# EAGLE design fanatone-adc2 (EAGLE 7.5.0)
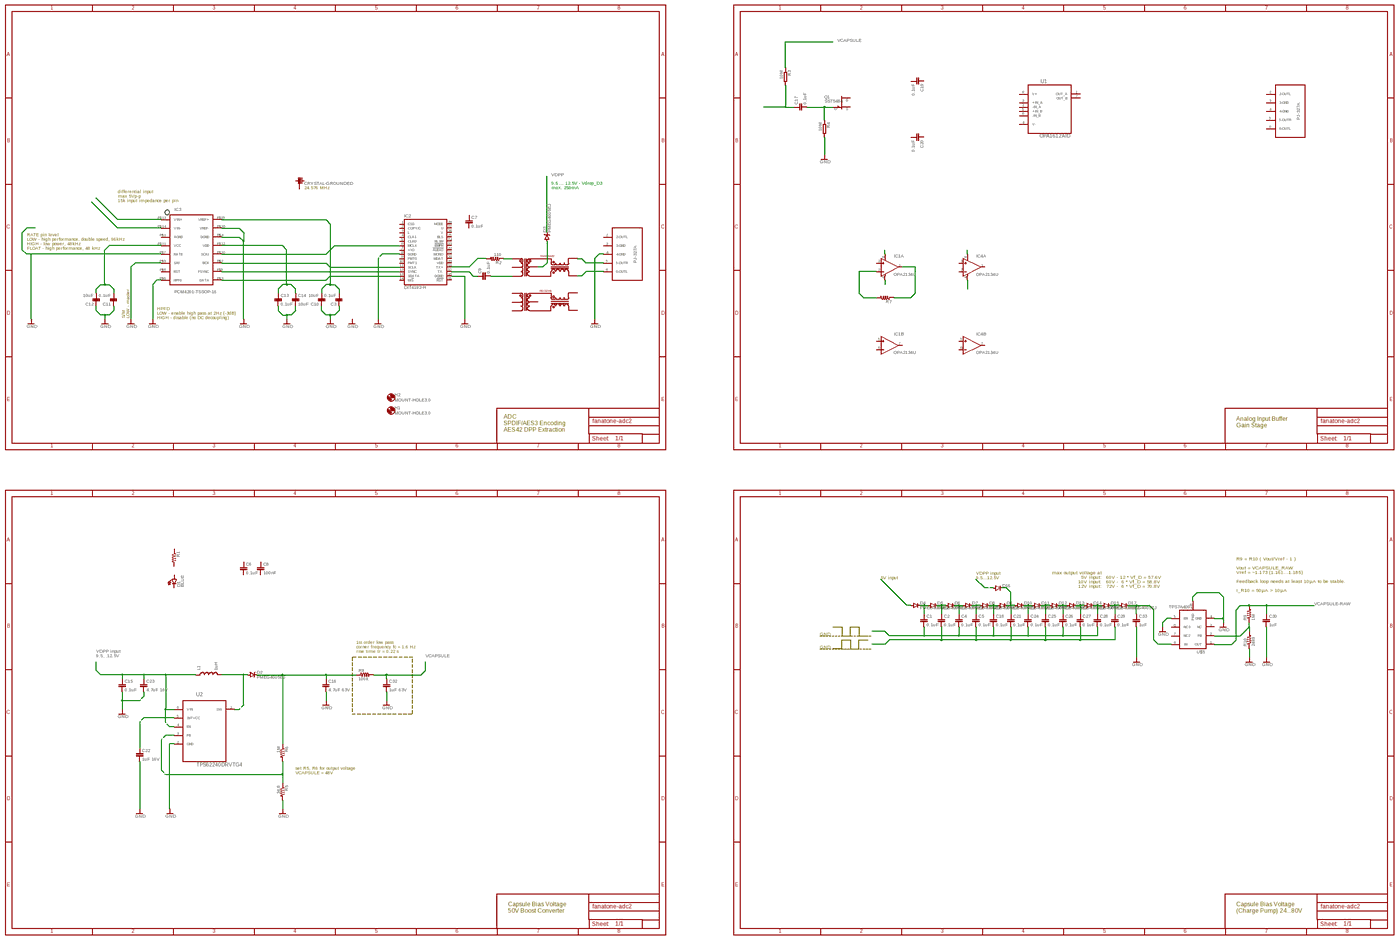
[diagram p0: schematic, sheet 1, overview]
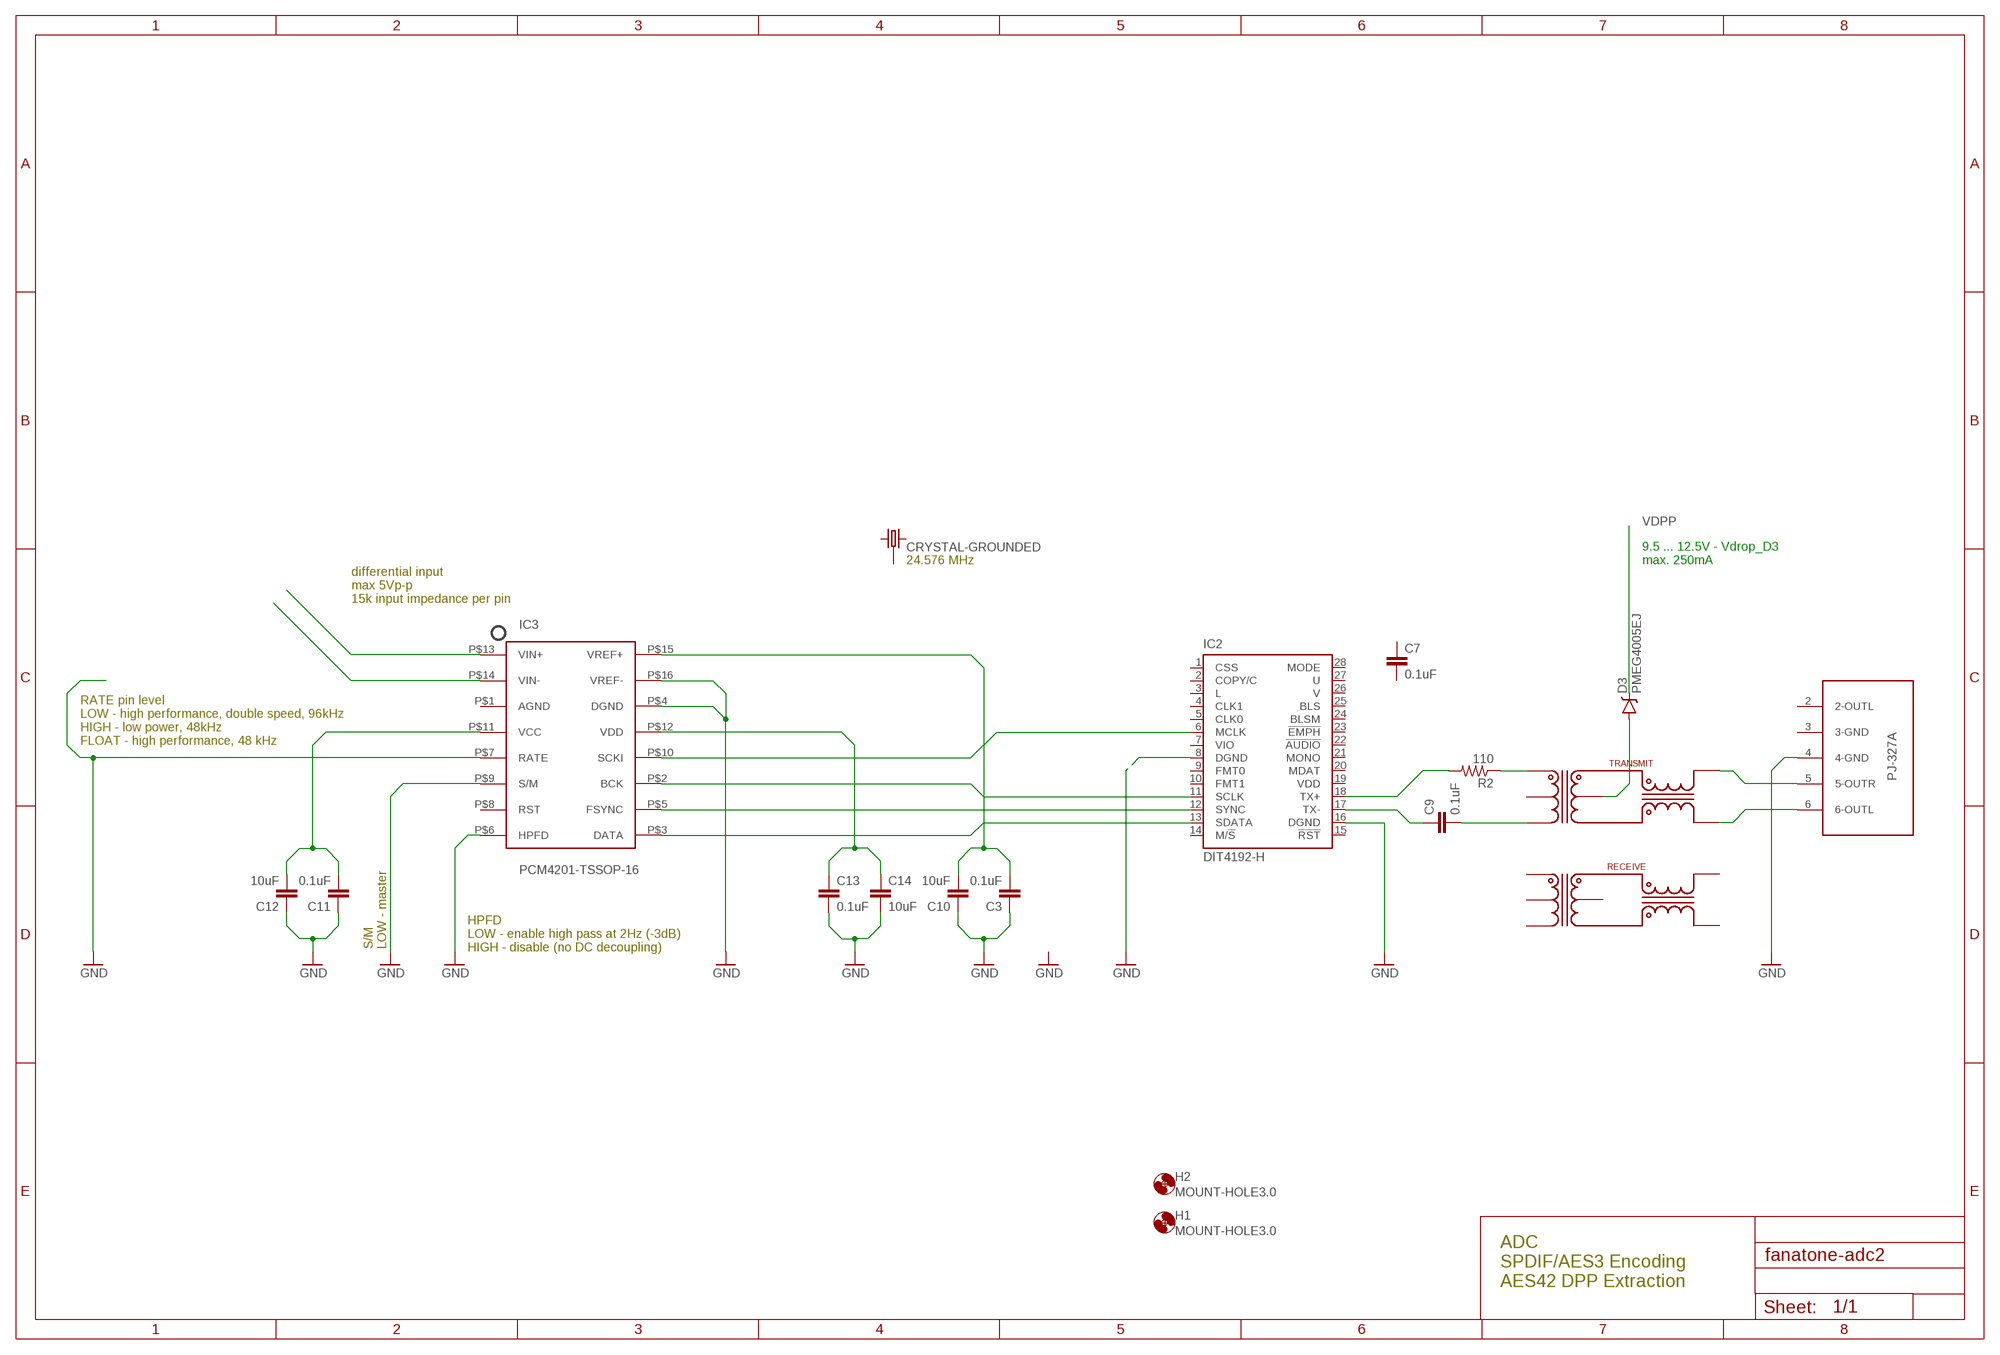
[diagram p1: schematic, sheet 1, part 1 of 4]
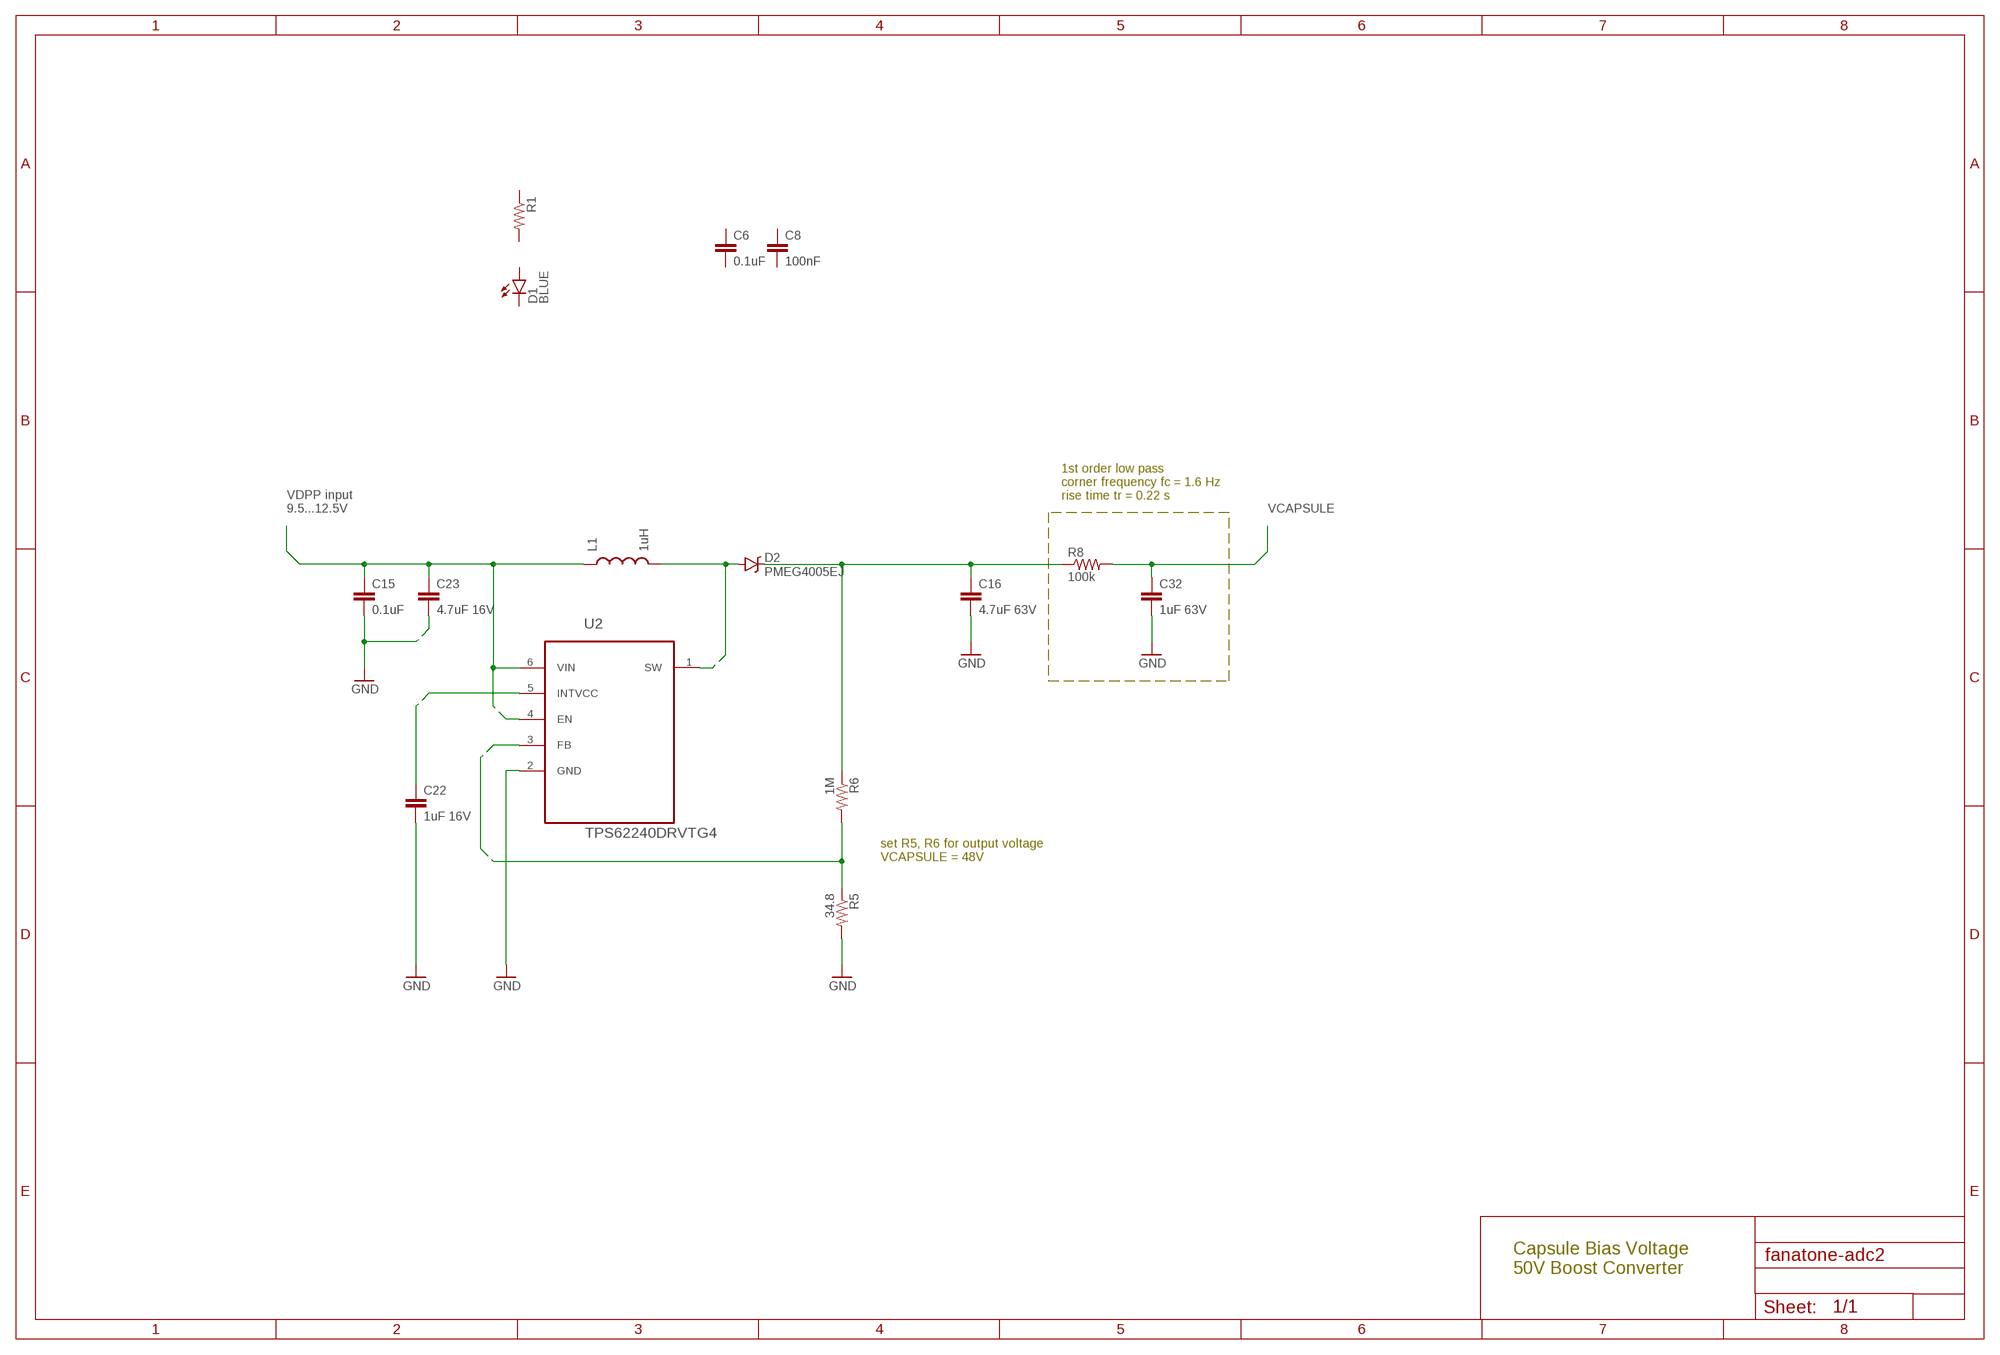
[diagram p2: schematic, sheet 1, part 2 of 4]
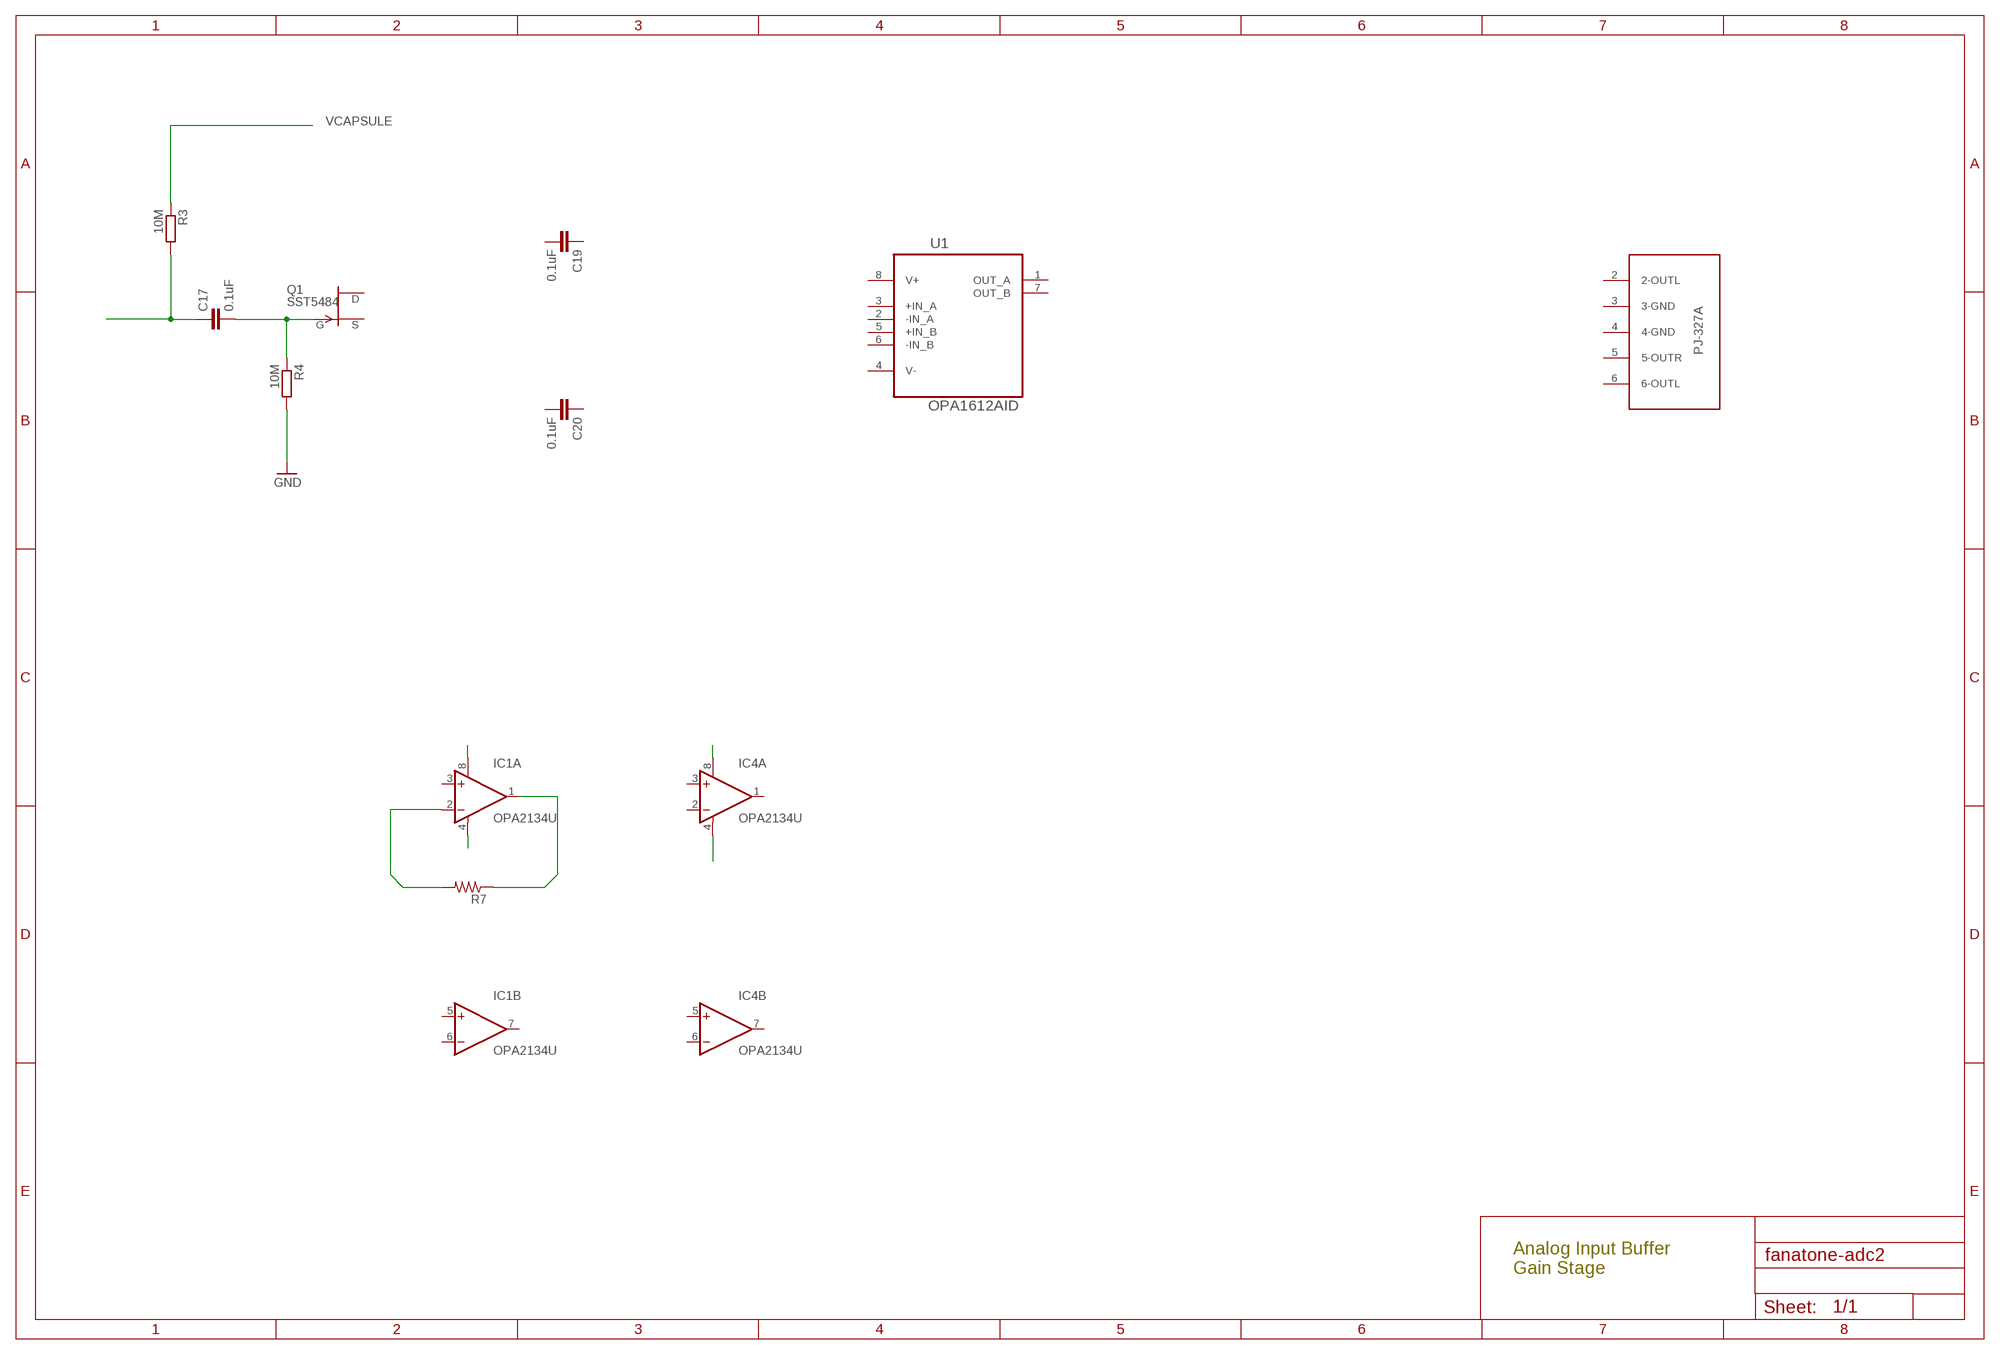
[diagram p3: schematic, sheet 1, part 3 of 4]
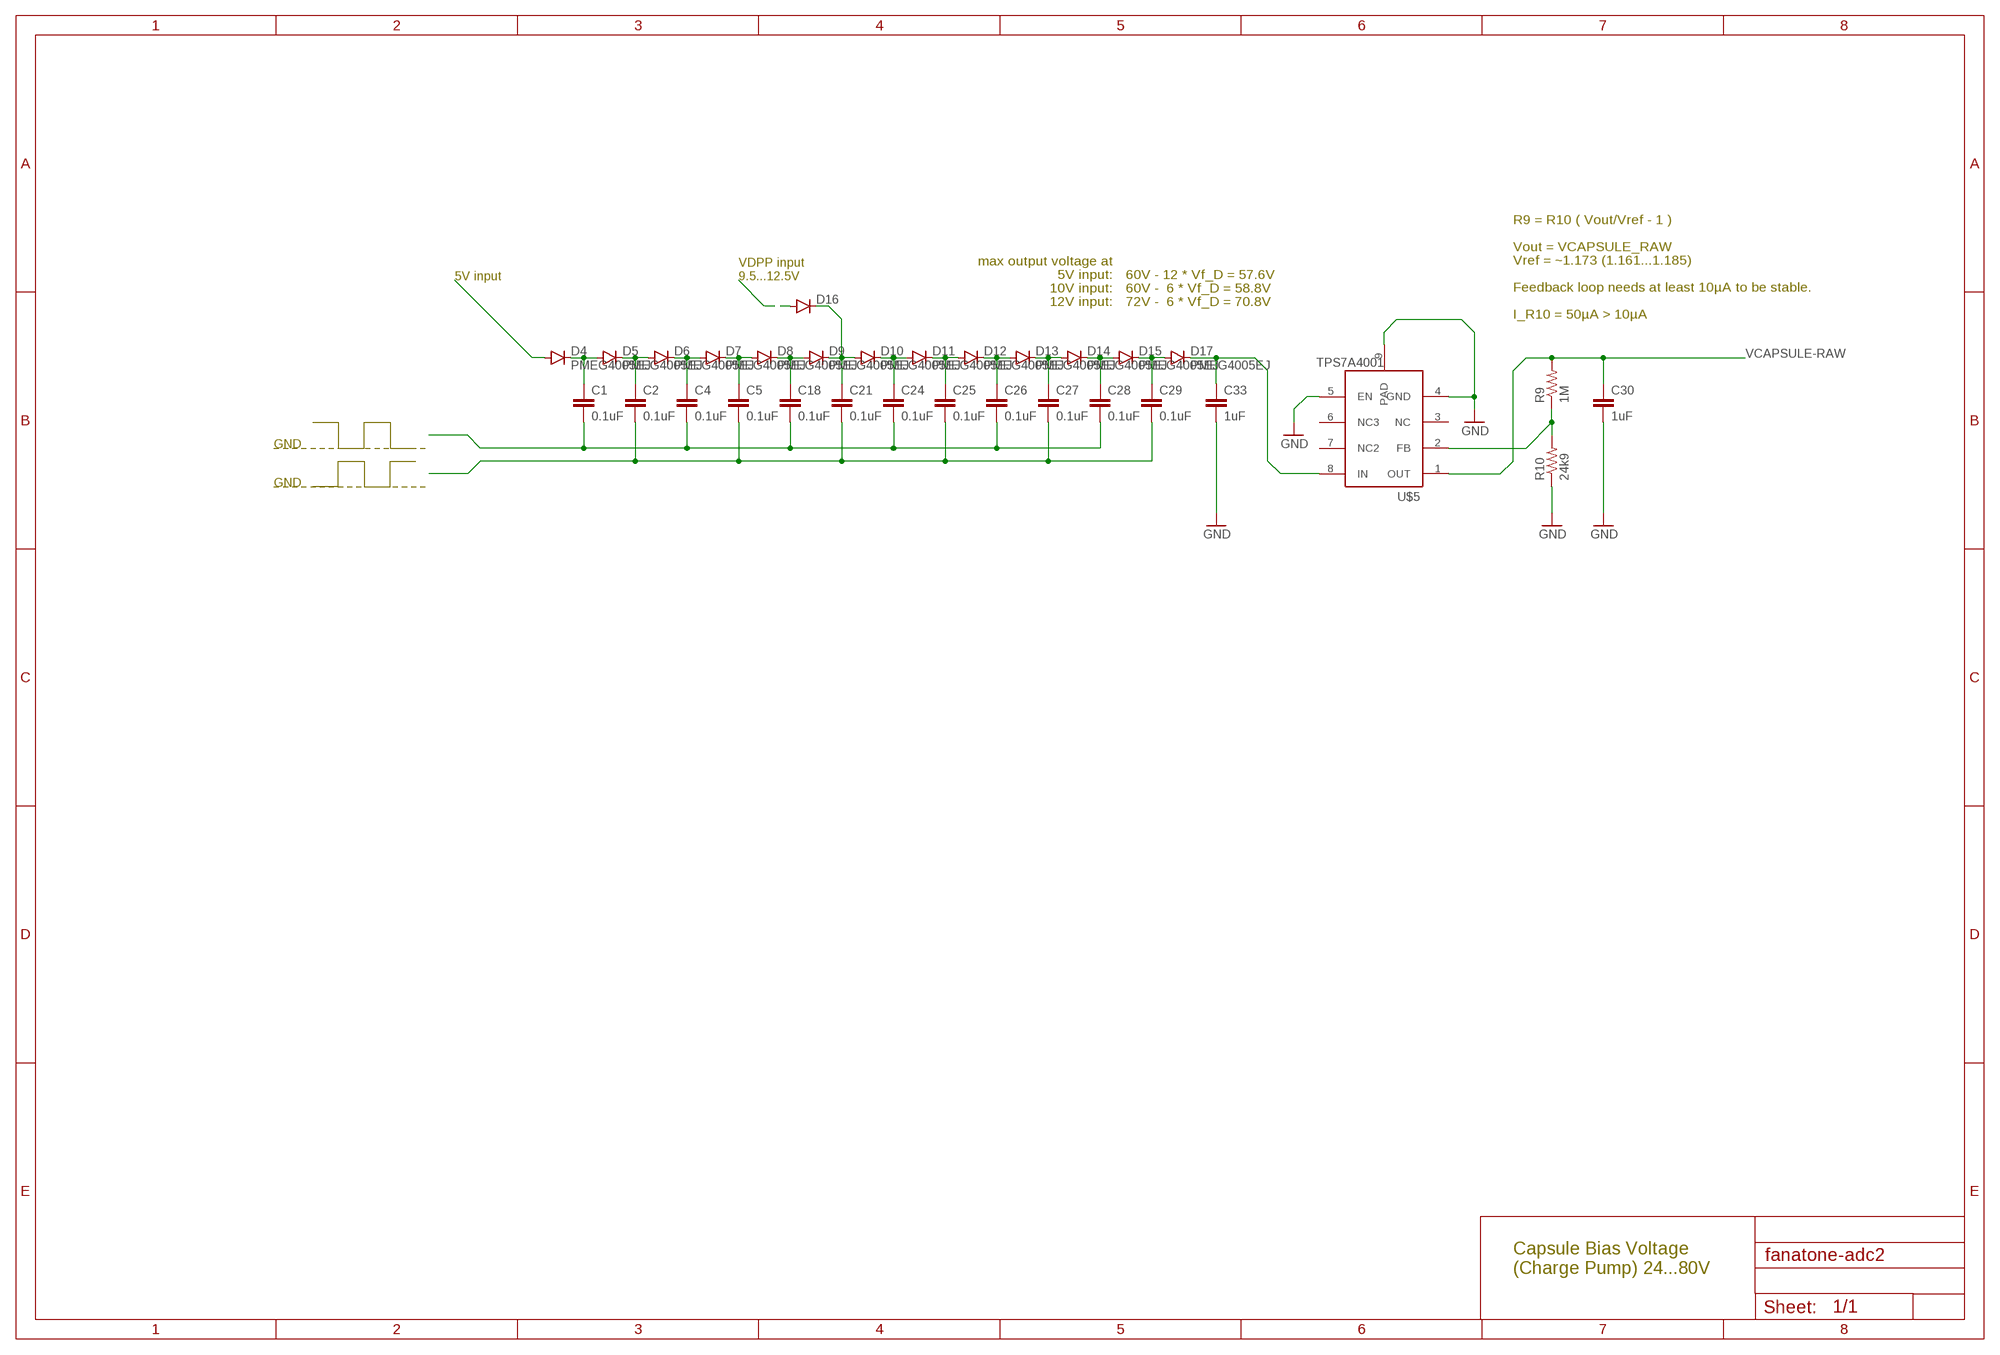
[diagram p4: schematic, sheet 1, part 4 of 4]

## Parts
C1  0.1uF  0.1UF-16V(+-10%)(0402)  [0402-CAP]
C2  0.1uF  0.1UF-16V(+-10%)(0402)  [0402-CAP]
C3  0.1uF  0.1UF-16V(+-10%)(0402)  [0402-CAP]
C4  0.1uF  0.1UF-16V(+-10%)(0402)  [0402-CAP]
C5  0.1uF  0.1UF-16V(+-10%)(0402)  [0402-CAP]
C6  0.1uF  0.1UF-16V(+-10%)(0402)  [0402-CAP]
C7  0.1uF  0.1UF-16V(+-10%)(0402)  [0402-CAP]
C8  100nF  CAP0402-CAP  [0402-CAP]
C9  0.1uF  0.1UF-16V(+-10%)(0402)  [0402-CAP]
C10  10uF  CAP0805  [0805]
C11  0.1uF  0.1UF-16V(+-10%)(0402)  [0402-CAP]
C12  10uF  CAP0805  [0805]
C13  0.1uF  0.1UF-16V(+-10%)(0402)  [0402-CAP]
C14  10uF  CAP0805  [0805]
C15  0.1uF  0.1UF-16V(+-10%)(0402)  [0402-CAP]
C16  4.7uF 63V  CAP0805  [0805]
C17  0.1uF  0.1UF-16V(+-10%)(0402)  [0402-CAP]
C18  0.1uF  0.1UF-16V(+-10%)(0402)  [0402-CAP]
C19  0.1uF  0.1UF-16V(+-10%)(0402)  [0402-CAP]
C20  0.1uF  0.1UF-16V(+-10%)(0402)  [0402-CAP]
C21  0.1uF  0.1UF-16V(+-10%)(0402)  [0402-CAP]
C22  1uF 16V  CAP0805  [0805]
C23  4.7uF 16V  CAP0805  [0805]
C24  0.1uF  0.1UF-16V(+-10%)(0402)  [0402-CAP]
C25  0.1uF  0.1UF-16V(+-10%)(0402)  [0402-CAP]
C26  0.1uF  0.1UF-16V(+-10%)(0402)  [0402-CAP]
C27  0.1uF  0.1UF-16V(+-10%)(0402)  [0402-CAP]
C28  0.1uF  0.1UF-16V(+-10%)(0402)  [0402-CAP]
C29  0.1uF  0.1UF-16V(+-10%)(0402)  [0402-CAP]
C30  1uF  CAP0805  [0805]
C32  1uF 63V  CAP0805  [0805]
C33  1uF  CAP0805  [0805]
D1  BLUE  LED-BLUE0603  [LED-0603]
D2  PMEG4005EJ  DIODE-SCHOTTKY-PMEG4005EJ  [SOD-323]
D3  PMEG4005EJ  DIODE-SCHOTTKY-PMEG4005EJ  [SOD-323]
D4  PMEG4005EJ  DIODESOD523  [SOD523]
D5  PMEG4005EJ  DIODESOD523  [SOD523]
D6  PMEG4005EJ  DIODESOD523  [SOD523]
D7  PMEG4005EJ  DIODESOD523  [SOD523]
D8  PMEG4005EJ  DIODESOD523  [SOD523]
D9  PMEG4005EJ  DIODESOD523  [SOD523]
D10  PMEG4005EJ  DIODESOD523  [SOD523]
D11  PMEG4005EJ  DIODESOD523  [SOD523]
D12  PMEG4005EJ  DIODESOD523  [SOD523]
D13  PMEG4005EJ  DIODESOD523  [SOD523]
D14  PMEG4005EJ  DIODESOD523  [SOD523]
D15  PMEG4005EJ  DIODESOD523  [SOD523]
D16  DIODESOD523  [SOD523]
D17  PMEG4005EJ  DIODESOD523  [SOD523]
H1  MOUNT-HOLE3.0  [3,0]
H2  MOUNT-HOLE3.0  [3,0]
IC1  OPA2134U  [SO08]
IC2  DIT4192-H  [PW_R-PDSO-G28]
IC3  PCM4201-TSSOP-16  [TSSOP-16]
IC4  OPA2134U  [SO08]
L1  1uH  INDUCTOR0805  [0805]
Q1  SST5484  [SOT23]
R1  RESISTOR0603-RES  [0603-RES]
R2  110  RESISTOR0603-RES  [0603-RES]
R3  10M  R-EU_R0805W  [R0805W]
R4  10M  R-EU_R0805W  [R0805W]
R5  34.8  RESISTOR0603-RES  [0603-RES]
R6  1M  RESISTOR0603-RES  [0603-RES]
R7  RESISTOR0603-RES  [0603-RES]
R8  100k  RESISTOR0603-RES  [0603-RES]
R9  1M  RESISTOR0603-RES  [0603-RES]
R10  24k9  RESISTOR0603-RES  [0603-RES]
U1  OPA1612AID  [SOIC127P600X175-8N]
U2  TPS62240DRVTG4  [SON65P210X210X80-7N]
U$1  CRYSTAL-GROUNDED  [CRYSTAL-SMD-5X3]
U$2  PJ-327A  [PJ-327A]
U$3  PJ-327A  [PJ-327A]
U$4  H1102  [H11XX]
U$5  TPS7A4001  [POWER-SOP8]

## Nets
3V3: C13.1 C14.1 IC3.P$12(VDD)
5V: C11.2 C12.2 IC3.P$11(VCC)
GND: C3.1 C10.1 C11.1 C12.1 C13.2 C14.2 C15.2 C16.2 C22.2 C23.2 C30.2 C32.2 C33.2 IC2.8(DGND) IC2.16(DGND) IC3.P$4(DGND) IC3.P$6(HPFD) IC3.P$7(RATE) IC3.P$9(S/M) IC3.P$16(VREF-) R4.2 R5.2 R10.1 U2.2(GND) U$2.4(4-GND) U$5.4(GND) U$5.5(EN) U$5.9(PAD)
N$1: C9.2 U$4.3
N$2: R2.1 U$4.1
N$3: C17.1 R3.2
N$4: C17.2 Q1.3(G) R4.1
N$5: C3.2 C10.2 IC3.P$15(VREF+)
N$6: IC2.18(TX+) R2.2
N$7: R5.1 R6.2 U2.3(FB)
N$8: C22.1 U2.5(INTVCC)
N$9: C9.1 IC2.17(TX-)
N$10: D3.A U$4.15
N$11: D2.A L1.2 U2.1(SW)
N$12: IC2.11(SCLK) IC3.P$2(BCK)
N$13: C4.1 D6.C D7.A
N$14: IC2.12(SYNC) IC3.P$5(FSYNC)
N$15: IC2.13(SDATA) IC3.P$3(DATA)
N$16: U$2.6(6-OUTL) U$4.14
N$17: IC2.6(MCLK) IC3.P$10(SCKI)
N$18: U$2.5(5-OUTR) U$4.16
N$19: IC3.P$13(VIN+)
N$20: IC3.P$14(VIN-)
N$21: IC1.1(A:OUT) R7.1
N$22: IC1.2(A:-IN) R7.2
N$23: IC1.4(A:V-)
N$24: IC1.8(A:V+)
N$25: IC4.8(A:V+)
N$26: IC4.4(A:V-)
N$27: C1.1 D4.C D5.A
N$28: C1.2 C4.2 C18.2 C24.2 C26.2 C28.2
N$29: C2.1 D5.C D6.A
N$30: C2.2 C5.2 C21.2 C25.2 C27.2 C29.2
N$31: D4.A
N$32: C29.1 D15.C D17.A
N$33: C5.1 D7.C D8.A
N$34: R9.1 R10.2 U$5.2(FB)
N$36: C18.1 D8.C D9.A
N$38: C21.1 D9.C D10.A D16.C
N$41: C24.1 D10.C D11.A
N$43: C25.1 D11.C D12.A
N$46: C26.1 D12.C D13.A
N$47: C27.1 D13.C D14.A
N$48: C28.1 D14.C D15.A
N$49: C33.1 D17.C U$5.8(IN)
VCAPSULE: C32.1 R3.1 R8.2
VCAPSULE-RAW: C16.1 C30.1 D2.C R6.1 R8.1 R9.2 U$5.1(OUT)
VDPP: C15.1 C23.1 D3.C D16.A L1.1 U2.4(EN) U2.6(VIN)
Unconnected: C6.1 C6.2 C7.1 C7.2 C8.1 C8.2 C19.1 C19.2 C20.1 C20.2 D1.A D1.C IC1.3(A:+IN) IC1.5(B:+IN) IC1.6(B:-IN) IC1.7(B:OUT) IC2.1(CSS) IC2.2(COPY/C) IC2.3(L) IC2.4(CLK1) IC2.5(CLK0) IC2.9(FMT0) IC2.10(FMT1) IC2.14(M/!S) IC2.15(!RST) IC2.20(MDAT) IC2.21(MONO) IC2.22(!AUDIO) IC2.23(!EMPH) IC2.24(BLSM) IC2.25(BLS) IC2.26(V) IC2.27(U) IC2.28(MODE) IC3.P$1(AGND) IC3.P$8(RST) IC4.1(A:OUT) IC4.2(A:-IN) IC4.3(A:+IN) IC4.5(B:+IN) IC4.6(B:-IN) IC4.7(B:OUT) Q1.1(D) Q1.2(S) R1.1 R1.2 U1.1(OUT_A) U1.2(-IN_A) U1.3(+IN_A) U1.5(+IN_B) U1.6(-IN_B) U1.7(OUT_B) U$1.1 U$1.2 U$1.3 U$1.4 U$2.2(2-OUTL) U$2.3(3-GND) U$3.2(2-OUTL) U$3.3(3-GND) U$3.4(4-GND) U$3.5(5-OUTR) U$3.6(6-OUTL) U$4.2 U$4.6 U$4.7 U$4.8 U$4.9 U$4.10 U$4.11 U$5.3(NC) U$5.6(NC3) U$5.7(NC2)

## Notes on the sheet
- 24.576 MHz
- 9.5 ... 12.5V - Vdrop_D3
  max. 250mA
- differential input
  max 5Vp-p
  15k input impedance per pin
- RATE pin level
  LOW - high performance, double speed, 96kHz
  HIGH - low power, 48kHz
  FLOAT - high performance, 48 kHz
- S/M
  LOW - master
- HPFD
  LOW - enable high pass at 2Hz (-3dB)
  HIGH - disable (no DC decoupling)
- Analog Input Buffer
  Gain Stage
- ADC
  SPDIF/AES3 Encoding
  AES42 DPP Extraction
- 5V input
- VDPP input
  9.5...12.5V
- max output voltage at
  5V input:
  10V input:
  12V input:
- 60V - 12 * Vf_D = 57.6V
  60V -  6 * Vf_D = 58.8V
  72V -  6 * Vf_D = 70.8V
- R9 = R10 ( Vout/Vref - 1 )
  
  Vout = VCAPSULE_RAW
  Vref = ~1.173 (1.161...1.185)
  
  Feedback loop needs at least 10µA to be stable.
  
  I_R10 = 50µA > 10µA
- GND
- GND
- 1st order low pass
  corner frequency fc = 1.6 Hz
  rise time tr = 0.22 s
- VDPP input
  9.5...12.5V
- set R5, R6 for output voltage
  VCAPSULE = 48V
- Capsule Bias Voltage
  50V Boost Converter
- Capsule Bias Voltage
  (Charge Pump) 24...80V

## Power pins joined to a net without a drawn wire
V+: U1.8(V+)
V-: U1.4(V-)
VDD: IC2.19(VDD)
VIO: IC2.7(VIO)

## Library data of the parts
C1-C7 C9 C11 C13 C15 C17-C21 C24-C29 = SparkFun-Capacitors:0.1UF-16V(+-10%)(0402); PROD_ID: CAP-12416
C8 C10 C12 C14 C16 C22 C23 C30 C32 C33 = SparkFun-Passives:CAP: Capacitor Standard 0603 ceramic capacitor, and 0.1" leaded capacitor.
D1 = SparkFun-LED:LED-BLUE: Blue LEDs for production use Various blue LEDs stocked by SparkFun production 0603 - DIO-08575 Rebel - DIO-09553 1206 - DIO-09911; PROD_ID: DIO-08575
D2 D3 = SparkFun-DiscreteSemi:DIODE-SCHOTTKY: Schottky diodes in SFE's production catalog BAT20J 1A 23V 0.62Vf RB751 120mA 40V 0.37Vf PMEG4005EJ 0.5A 40V 0.42Vf MBRA140 1A 40V 0.5Vf B340A 3A 40V SMA; PROD_ID: DIO-10955
D4-D17 = SparkFun-DiscreteSemi:DIODE: Diode These are standard reverse protection diodes and small signal diodes. SMA package can handle up to about 1A. SOD-323 can handle about 200mA. What the SOD-323 package when ordering, there are some mfgs out there that are 5-pin packages.
H1 H2 = holes:MOUNT-HOLE: MOUNTING HOLE with drill center marker
IC1 IC4 = burr-brown:OPA2134: Operational Amplifier; MF: TEXAS INSTRUMENTS; MPN: OPA2134UA; OC_FARNELL: 1206935; OC_NEWARK: 35C1847
IC2 = texas:DIT4192-H: 192kHz Digital Audio Transmitter Hardware Mode Source: http://focus.ti.com/lit/ds/symlink/dit4192.pdf; MF: TEXAS INSTRUMENTS; MPN: DIT4192IPW; OC_FARNELL: 7455057; OC_NEWARK: 74C9511
IC3 = TI-PCM4201:PCM4201
L1 = SparkFun-Passives:INDUCTOR: Inductors Basic Inductor/Choke - 0603 and 1206. Footprints are not proven and vary greatly between part numbers. INDUCTOR POWER 3.3UH 4.0A SMD 0.197" L x 0.197" W x 0.177" H (5.00mm x 5.00mm x 4.50mm)
Q1 = transistor-fet:?548*: N-Channel JFETs Source: VISHAY 2N5484.pdf Compatible: TO92 2N5245 J304 J305 U310 J308 J309 J310 TO72 2N4416 2N4416A 2N3823 2N4351 3N169 3N170 3N171 MFE3002 TO18 2N3796 2N3797 MFE825 Source: Motorola European Master Guide Pacge 3-59
R1 R2 R5-R10 = SparkFun-Passives:RESISTOR: Resistor Basic schematic elements and footprints for 0603, 1206, and PTH resistors.
R3 R4 = rcl:R-EU_: RESISTOR, European symbol
U1 = LT8330-boost-TSOT23:OPA1612AID: AUDIO OPERATIONAL AMPLIFIERS; MPN: OPA1612AID; OC_FARNELL: 1754265; OC_NEWARK: 25R6133; PACKAGE: SOIC-8; SUPPLIER: TI
U2 = LT8330-boost-TSOT23:TPS62240DRVTG4: 2.25 MHz 300 mA Step Down Converter in 2x2SON/TSOT23 Package; MPN: LT8330; PACKAGE: SON-6; SUPPLIER: Linear Technology
U$1 = SparkFun-FreqCtrl:CRYSTAL-GROUNDED
U$2 U$3 = PJ327A-TRS:PJ-327A
U$4 = trafo-pulse:H1102: PULSE SMT Ethernet transformer RX 1:1, TX 1:1, Central Tap
U$5 = SparkFun-AnalogIC:TPS7A4001

## Board
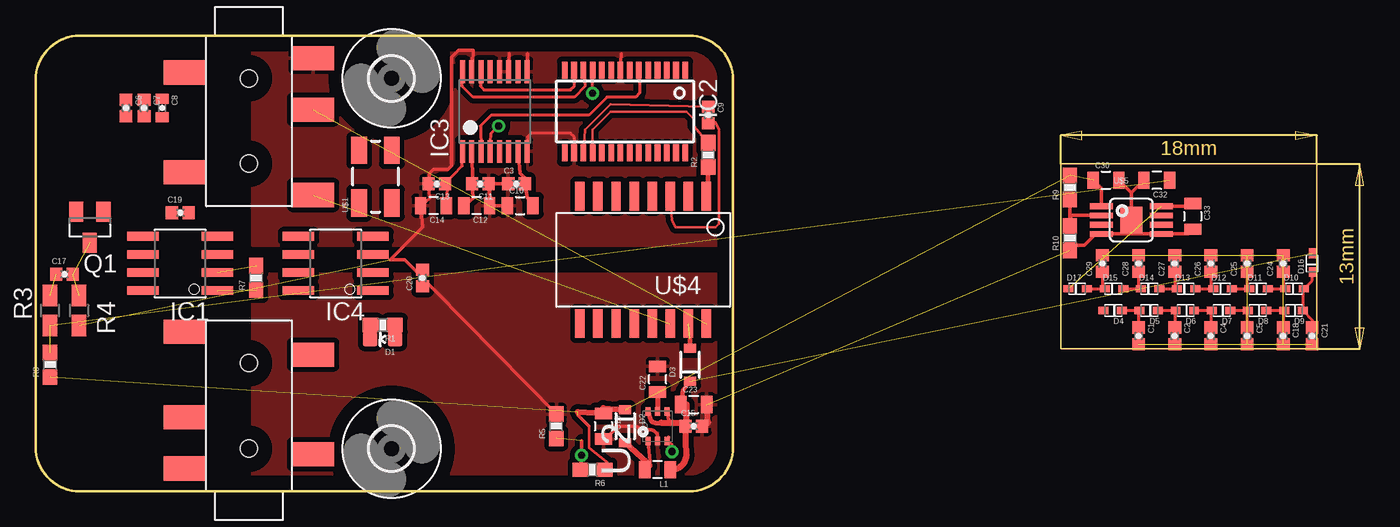
[diagram p5: board, top side]
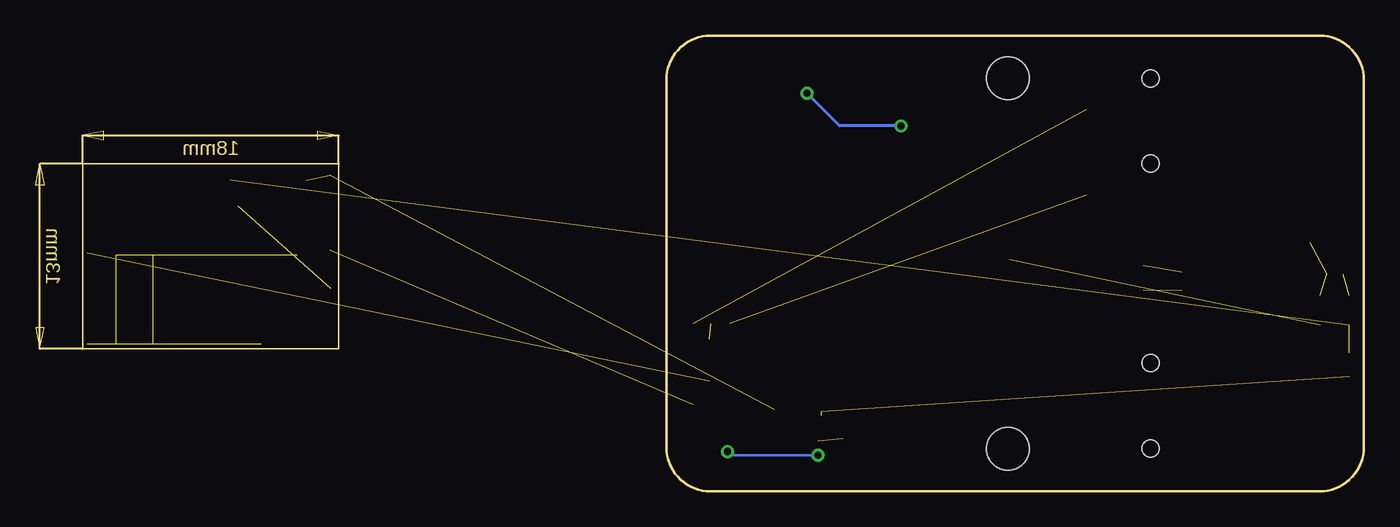
[diagram p6: board, bottom side, seen from below]

Size 90 x 32 mm. Coordinates in mm from the lower left corner, seen from the top.
Outline: 0,3.1 0,28.9 arc-90 3.1,32 45.9,32 arc-90 49,28.9 49,3.1 arc-90 45.9,0 3.1,0 arc-90 0,3.1
Outline: 72,23 72,10 90,10 90,23 72,23
Copper layers (1*16): Top 0.035mm / dielectric 1.5mm / Bottom 0.035mm
Design rules "default *": minimum track width 7mil, minimum drill 24mil, track to track 8mil, track to pad 8mil, pad to pad 8mil, via to via 8mil, smd to smd 8mil, copper to edge 40mil, drill to drill 8mil, minimum pad ring 10mil, minimum via ring 8mil, stop-mask expansion 1mil, vias tented up to drill 0mil, thermal gap 10mil

### Footprints (pad centres in the part's own frame; a part is rotated, then mirrored left to right if it is on the bottom)
0402-CAP = smd 0.85 x 0.9: 1 -0.58,0; 2 0.58,0
0402-CAP' = smd 0.7 x 0.9: 1 -0.65,0; 2 0.65,0
0805 = smd 0.8 x 1.2: 1 -0.9,0; 2 0.9,0
LED-0603 = smd 1 x 1: A 0,-0.877; C 0,0.877
SOD-323 = smd 0.63 x 0.83: A 1.15,0; C -1.15,0
SOD523 = smd 0.7 x 0.5: A 0.7,0; C -0.6,0
3,0 = hole 3: 0,0
SO08 = smd 0.61 x 2.21: 1 -1.905,-2.616; 2 -0.635,-2.616; 3 0.635,-2.616; 4 1.905,-2.616; 5 1.905,2.616; 6 0.635,2.616; 7 -0.635,2.616; 8 -1.905,2.616
PW_R-PDSO-G28 = smd 0.4 x 1.2: 1 -4.225,-2.9; 2 -3.575,-2.9; 3 -2.925,-2.9; 4 -2.275,-2.9; 5 -1.625,-2.9; 6 -0.975,-2.9; 7 -0.325,-2.9; 8 0.325,-2.9; 9 0.975,-2.9; 10 1.625,-2.9; 11 2.275,-2.9; 12 2.925,-2.9; 13 3.575,-2.9; 14 4.225,-2.9; 15 4.225,2.9; 16 3.575,2.9; 17 2.925,2.9; 18 2.275,2.9; 19 1.625,2.9; 20 0.975,2.9; 21 0.325,2.9; 22 -0.325,2.9; 23 -0.975,2.9; 24 -1.625,2.9; 25 -2.275,2.9; 26 -2.925,2.9; 27 -3.575,2.9; 28 -4.225,2.9
TSSOP-16 = smd 0.35 x 1.6: P$1 -0.325,2.8; P$2 -0.325,-2.8; P$3 -0.975,2.8; P$4 -1.625,2.8; P$5 -2.275,2.8; P$6 0.325,2.8; P$7 0.975,2.8; P$8 1.625,2.8; P$9 2.275,2.8; P$10 -0.975,-2.8; P$11 -1.625,-2.8; P$12 -2.275,-2.8; P$13 0.325,-2.8; P$14 0.975,-2.8; P$15 1.625,-2.8; P$16 2.275,-2.8
SOT23 = smd 1 x 1.4: 1 -0.95,-1.1; 2 0.95,-1.1; 3 0,1.1
0603-RES = smd 1.1 x 1: 1 -0.85,0; 2 0.85,0
R0805W = smd 1.5 x 1: 1 -1.052,0; 2 1.052,0
SOIC127P600X175-8N = smd 1.981 x 0.559: 1 -2.464,1.905; 2 -2.464,0.635; 3 -2.464,-0.635; 4 -2.464,-1.905; 5 2.464,-1.905; 6 2.464,-0.635; 7 2.464,0.635; 8 2.464,1.905
SON65P210X210X80-7N = smd 0.61 x 0.356: 1 -1.041,0.66; 2 -1.041,0; 3 -1.041,-0.66; 4 1.041,-0.66; 5 1.041,0; 6 1.041,0.66 | smd 0.003 x 0.003: 7 0,0
CRYSTAL-SMD-5X3 = smd 1.9 x 1.1: 1 -1.85,-1.15; 2 1.85,-1.15; 3 1.85,1.15; 4 -1.85,1.15
PJ-327A = smd 1.7 x 3: 2 9.6,-4.5; 3 2.6,-4.5; 4 1.6,4.5; 5 5.2,4.5; 6 11.2,4.5 | hole 1.2: 3,0; 9,0
H11XX = smd 0.66 x 2.032: 1 -4.445,-4.47; 2 -3.175,-4.47; 3 -1.905,-4.47; 4 -0.635,-4.47; 5 0.635,-4.47; 6 1.905,-4.47; 7 3.175,-4.47; 8 4.445,-4.47; 9 4.445,4.47; 10 3.175,4.47; 11 1.905,4.47; 12 0.635,4.47; 13 -0.635,4.47; 14 -1.905,4.47; 15 -3.175,4.47; 16 -4.445,4.47
POWER-SOP8 = smd 0.4 x 1.6: 1 -0.975,-2.1; 2 -0.325,-2.1; 3 0.325,-2.1; 4 0.975,-2.1; 5 0.975,2.1; 6 0.325,2.1; 7 -0.325,2.1; 8 -0.975,2.1 | smd 1.89 x 1.57: 9 0,0

### Placement (x,y rotation side)
C1  77.47,10.92 270 top
C2  80.01,10.92 270 top
C3  33.78,21.59 0 top
C4  82.55,10.92 270 top
C5  85.09,10.92 270 top
C6  6.35,26.92 270 top
C7  7.62,26.92 270 top
C8  100nF  [0402-CAP']  8.89,26.92 270 top
C9  47.24,26.42 270 top
C10  34.04,20.07 0 top
C11  31.24,21.59 180 top
C12  30.99,20.07 180 top
C13  28.19,21.59 180 top
C14  27.94,20.07 180 top
C15  46.23,4.57 0 top
C16  39.88,4.57 270 top
C17  2.03,15.24 0 top
C18  87.63,10.92 270 top
C19  10.16,19.56 0 top
C20  27.18,14.99 90 top
C21  89.66,10.92 270 top
C22  43.69,7.87 90 top
C23  46.23,6.1 0 top
C24  87.63,16 90 top
C25  85.09,16 90 top
C26  82.55,16 90 top
C27  80.01,16 90 top
C28  77.47,16 90 top
C29  74.93,16 90 top
C30  75.18,21.84 0 top
C32  78.74,21.84 180 top
C33  81.28,19.3 270 top
D1  24.38,10.67 90 top
D2  41.4,4.57 270 top
D3  45.97,8.89 90 top
D4  75.69,12.7 180 top
D5  78.23,12.7 180 top
D6  80.77,12.7 180 top
D7  83.31,12.7 180 top
D8  85.85,12.7 180 top
D9  88.39,12.7 180 top
D10  88.39,14.22 0 top
D11  85.85,14.22 0 top
D12  83.31,14.22 0 top
D13  80.77,14.22 0 top
D14  78.23,14.22 0 top
D15  75.69,14.22 0 top
D16  89.66,16 90 top
D17  73.15,14.22 0 top
H1  25,3 0 top
H2  25,29 0 top
IC1  10.16,16 90 top
IC2  41.4,26.67 180 top
IC3  32.26,26.67 0 top
IC4  21.08,16 90 top
L1  43.69,1.52 180 top
Q1  3.81,18.54 180 top
R1  24.38,11.68 180 top
R2  47.24,23.62 90 top
R3  1.02,12.7 90 top
R4  3.05,12.7 270 top
R5  36.58,4.57 90 top
R6  39.12,1.52 180 top
R7  15.49,14.99 90 top
R8  1.02,8.89 90 top
R9  72.64,21.34 90 top
R10  72.64,17.78 90 top
U1  61.98,40.64 0 top  (outside the outline)
U2  43.69,4.57 90 top
U$1  23.88,22.1 90 top
U$2  14.99,32 270 top
U$3  14.99,0 90 top
U$4  42.67,16.26 180 top
U$5  76.96,19.05 270 top

### Tracks (layer width: path | path; a pad name or v marks a point on that pad's centre or on a via)
3V3
  Top 0.203: C14.1 28.96,21.59 C13.1 29.97,22.86 IC3.P$12
5V
  Top 0.254: IC3.P$11 30.73,21.59 C11.2 30.73,20.57 C12.2
GND  (2 unrouted)
  Top 0.203: IC2.8 41.15,30.73 | IC3.P$7 33.27,30.73 | IC2.16 37.85,24.89 37.59,25.15 34.8,25.15 34.54,24.89 34.54,23.88 IC3.P$16 | C13.2 27.69,20.57 C14.2
  Top 0.254: C16.2 40.13,3.81 40.89,4.57 42.16,4.57 arc28 43.18,4.32 arc-90 43.69,3.81 U2.2 | C3.1 C11.1 32,20.07 | C10.1 32,20.07 | 32,20.07 C12.1 | C12.1 32,20.07 | 32,20.07 C12.1 | 32,20.07 C12.1 | C14.2 27.18,18.54 24.89,16.26 25.91,16.26 R5.2 | IC3.P$4 30.73,30.73 30.73,30.99 30.48,30.99 29.72,30.99 29.21,30.48 29.21,22.86 28.96,22.61 27.94,22.61 27.69,22.35 C13.2 | IC3.P$7 33.27,30.73 | IC3.P$9 34.54,30.73 | C33.2 80.95,18.07 U$5.5 77.22,18.07 | 77.22,18.07 U$5.4 74.46,18.07 73.66,17.27 72.99,17.27 R10.1 | U$5.9 76.96,18.33 77.22,18.07 | C30.2 76.96,20.97 | 76.96,20.97 U$5.9 | C32.2 76.96,20.97 | 76.96,20.97 U$5.9
  Top 0.406: C15.2 47.24,4.83 C23.2
  pour Top (isolate 0.356): 15.24,0 48.77,0 48.77,15.24 15.24,15.24
  pour Top (isolate 0.356): 48.77,32 48.77,17.27 15.24,17.27 15.24,32
N$1
  Top 0.178: U$4.3 44.7,19.05 44.96,18.54 47.75,18.54 48.01,18.8 48.01,25.4 47.75,25.91 C9.2
N$2
  Top 0.305: R2.1 47.24,20.83 U$4.1
N$3  (1 unrouted)
N$4  (2 unrouted)
N$5
  Top 0.254: IC3.P$15 34.04,22.35 34.54,21.84 C3.2 34.54,20.57 C10.2
N$6
  Top 0.178: IC2.18 39.12,25.4 40.39,26.67 45.72,26.67 46.23,26.16 46.23,25.65 R2.2
N$7  (via drill 0.51)  (1 unrouted)
  Top 0.178: U2.3 44.7,3.3 v44.7,2.79
  Top 0.254: 44.45,3.81 U2.3 | 38.35,3.56 v38.35,2.54 R6.2
  Bottom 0.178: v44.7,2.79 44.45,2.54 v38.35,2.54
N$8
  Top 0.356: C22.1 U2.5
N$9
  Top 0.178: C9.1 40.39,27.18 38.61,25.4 IC2.17
N$10  (1 unrouted)
  Top 0.305: 45.97,10.67 D3.A
N$11
  Top 0.254: U2.1 43.18,1.78 L1.2 42.93,2.03
  Top 0.406: D2.A 42.93,2.03
N$12  (via drill 0.5)
  Top 0.203: IC3.P$2 32,25.15 v32.51,25.65 | v39.12,27.94 39.12,28.45 IC2.11
  Bottom 0.203: v32.51,25.65 36.83,25.65 v39.12,27.94
N$13
  Top 0.203: D6.C D7.A 82.55,12.64 C4.1
N$14
  Top 0.203: IC2.12 38.61,28.45 37.85,27.69 30.73,27.69 29.97,28.45 IC3.P$5
N$15
  Top 0.203: IC3.P$3 31.24,28.45 31.5,28.19 37.59,28.19 37.85,28.45 IC2.13
N$16  (1 unrouted)
N$17
  Top 0.203: IC2.6 42.42,27.94 42.16,27.69 40.13,27.69 38.86,26.42 32,26.42 31.24,25.65 IC3.P$10
N$18  (1 unrouted)
N$21  (1 unrouted)
N$22  (1 unrouted)
N$27
  Top 0.203: D4.C D5.A 77.47,12.64 C1.1
N$28  (5 unrouted)
N$29
  Top 0.203: D5.C D6.A 80.01,12.64 C2.1
N$30  (5 unrouted)
N$32
  Top 0.203: D17.A D15.C 74.93,14.39 C29.1
N$33
  Top 0.203: D7.C D8.A 85.09,12.64 C5.1
N$34
  Top 0.254: R9.1 R10.2 72.74,19.38 U$5.2
N$36
  Top 0.203: D8.C D9.A 87.63,12.64 C18.1
N$38
  Top 0.203: C21.1 89.66,12.03 D9.C 88.99,14.12 D10.A 89.66,14.79 D16.C
N$41
  Top 0.203: D11.A D10.C 87.63,14.39 C24.1
N$43
  Top 0.203: D12.A D11.C 85.09,14.39 C25.1
N$46
  Top 0.203: D13.A D12.C 82.55,14.39 C26.1
N$47
  Top 0.203: D14.A D13.C 80.01,14.39 C27.1
N$48
  Top 0.203: D15.A D14.C 77.47,14.39 C28.1
N$49  (1 unrouted)
  Top 0.254: C33.1 81.1,20.02 U$5.8
VCAPSULE  (2 unrouted)
VCAPSULE-RAW  (4 unrouted)
  Top 0.178: 38.86,4.57 38.86,3.05 40.13,2.03 R6.1
  Top 0.254: C16.1 39.88,5.84 | 38.1,5.33 38.86,4.57 | C30.1 74.86,21.27 U$5.1
  Top 0.406: 39.88,5.84 D2.C | 38.1,5.59 C16.1
VDPP  (1 unrouted)
  Top 0.254: C23.1 45.72,6.1 | U2.4 44.45,5.33 arc90 44.7,4.83
  Top 0.305: U2.6 43.18,5.08 arc58 43.43,4.83 arc32 43.94,4.83 | D3.C 45.47,7.11 C23.1
  Top 0.406: 45.72,6.1 C15.1 | 43.94,4.83 44.7,4.83 45.72,4.83 C15.1 | L1.1 arc90 45.72,2.54 C15.1